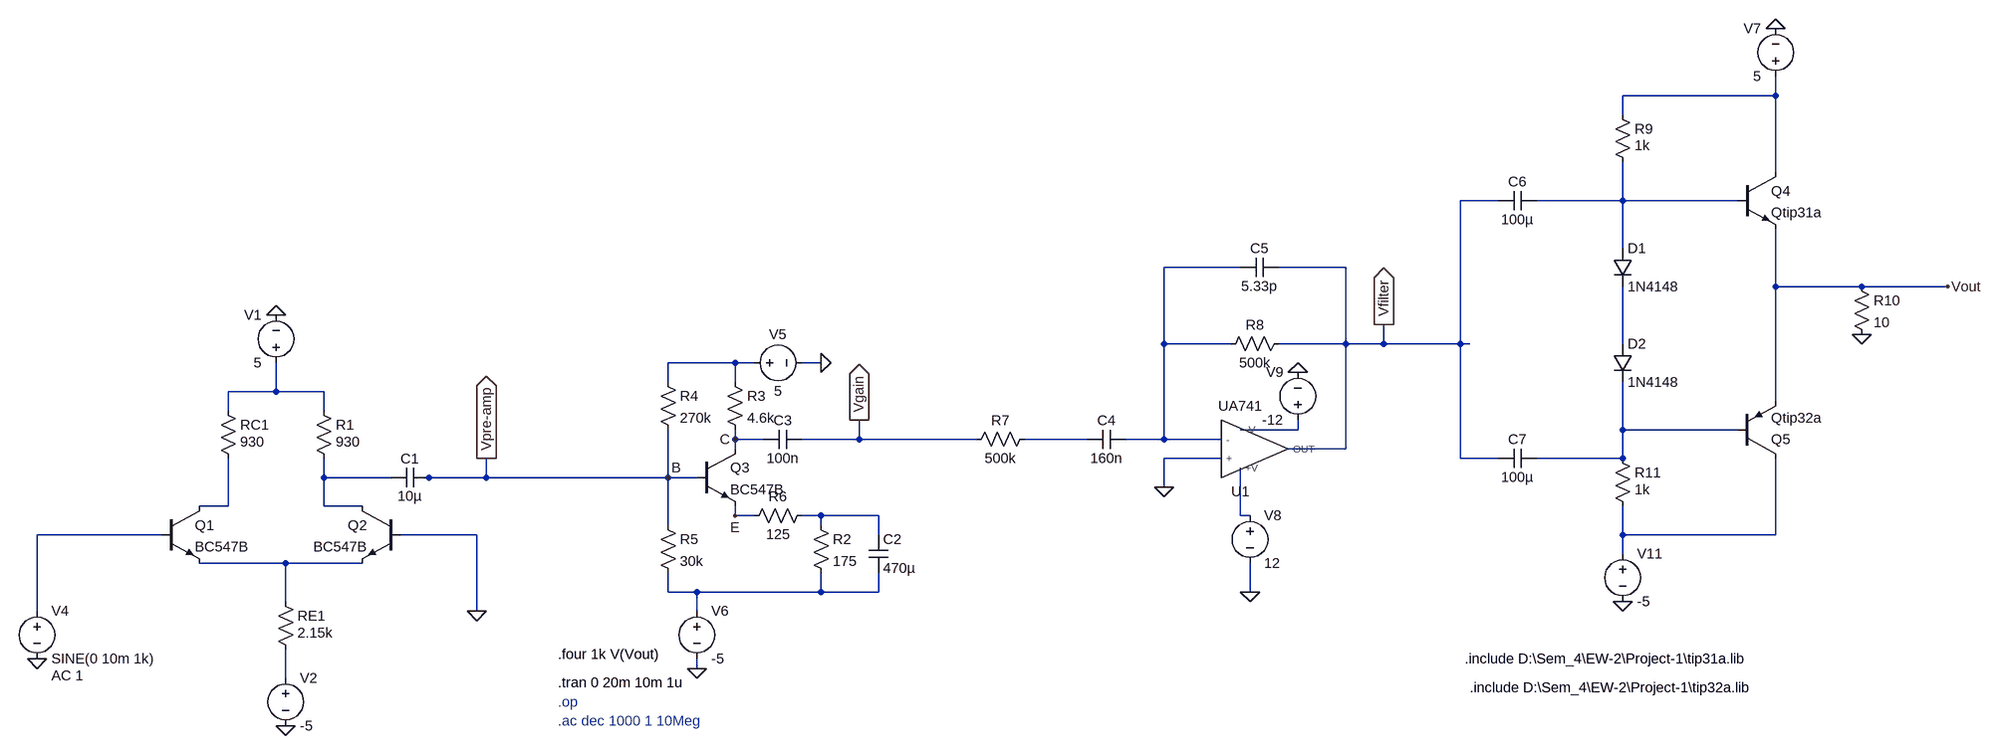
[diagram p0: schematic final_circuit.asc]
final_circuit.asc, the LTspice schematic file:
Version 4
SHEET 1 2568 680
WIRE 2208 -704 2208 -736
WIRE 2208 -704 1952 -704
WIRE 1952 -672 1952 -704
WIRE 2208 -576 2208 -704
WIRE 1744 -528 1680 -528
WIRE 1952 -528 1952 -592
WIRE 1952 -528 1808 -528
WIRE 2144 -528 1952 -528
WIRE 1952 -448 1952 -528
WIRE 1264 -416 1136 -416
WIRE 1440 -416 1328 -416
WIRE 2208 -384 2208 -480
WIRE 2352 -384 2208 -384
WIRE 2496 -384 2352 -384
WIRE 1136 -288 1136 -416
WIRE 1248 -288 1136 -288
WIRE 1440 -288 1440 -416
WIRE 1440 -288 1328 -288
WIRE 1504 -288 1504 -320
WIRE 1504 -288 1440 -288
WIRE 1680 -288 1680 -528
WIRE 1680 -288 1504 -288
WIRE 1696 -288 1680 -288
WIRE 1952 -288 1952 -384
WIRE 400 -256 288 -256
WIRE 432 -256 400 -256
WIRE 544 -256 512 -256
WIRE 288 -224 288 -256
WIRE 400 -224 400 -256
WIRE -528 -208 -528 -256
WIRE -528 -208 -608 -208
WIRE -448 -208 -528 -208
WIRE 2208 -192 2208 -384
WIRE -608 -176 -608 -208
WIRE -448 -176 -448 -208
WIRE 1360 -144 1360 -160
WIRE 1360 -144 1264 -144
WIRE 1952 -144 1952 -224
WIRE 2144 -144 1952 -144
WIRE 400 -128 400 -144
WIRE 448 -128 400 -128
WIRE 608 -128 608 -160
WIRE 608 -128 512 -128
WIRE 816 -128 608 -128
WIRE 1008 -128 896 -128
WIRE 1136 -128 1136 -288
WIRE 1136 -128 1072 -128
WIRE 1232 -128 1136 -128
WIRE 400 -112 400 -128
WIRE 1440 -112 1440 -288
WIRE 1440 -112 1344 -112
WIRE 1232 -96 1136 -96
WIRE 1680 -96 1680 -288
WIRE 1744 -96 1680 -96
WIRE 1952 -96 1952 -144
WIRE 1952 -96 1808 -96
WIRE -448 -64 -448 -96
WIRE -336 -64 -448 -64
WIRE -272 -64 -288 -64
WIRE -176 -64 -176 -96
WIRE -176 -64 -272 -64
WIRE 288 -64 288 -144
WIRE 288 -64 -176 -64
WIRE 336 -64 288 -64
WIRE 1136 -48 1136 -96
WIRE -608 -16 -608 -96
WIRE -608 -16 -656 -16
WIRE -448 -16 -448 -64
WIRE -384 -16 -448 -16
WIRE 400 0 400 -16
WIRE 432 0 400 0
WIRE 544 0 512 0
WIRE 640 0 544 0
WIRE 1264 0 1264 -80
WIRE 1280 0 1264 0
WIRE 288 16 288 -64
WIRE 544 16 544 0
WIRE -720 32 -928 32
WIRE -192 32 -320 32
WIRE 640 32 640 0
WIRE 1952 32 1952 -16
WIRE 2208 32 2208 -96
WIRE 2208 32 1952 32
WIRE 1952 64 1952 32
WIRE -512 80 -656 80
WIRE -384 80 -512 80
WIRE 288 128 288 96
WIRE 336 128 288 128
WIRE 544 128 544 96
WIRE 544 128 336 128
WIRE 640 128 640 96
WIRE 640 128 544 128
WIRE 1280 128 1280 80
WIRE -512 144 -512 80
WIRE -928 160 -928 32
WIRE -192 160 -192 32
WIRE 336 160 336 128
WIRE 336 256 336 240
WIRE -512 272 -512 224
FLAG -528 -336 0
FLAG -512 352 0
FLAG -928 240 0
FLAG 336 256 0
FLAG 544 -256 0
FLAG 400 -128 C
FLAG 400 0 E
FLAG 288 -64 B
FLAG 1136 -48 0
FLAG 1280 128 0
FLAG 1360 -240 0
FLAG 2208 -816 0
FLAG 2496 -384 Vout
FLAG 2352 -304 0
FLAG 1952 144 0
FLAG -192 160 0
FLAG 1504 -320 Vfilter
IOPIN 1504 -320 Out
FLAG 608 -160 Vgain
IOPIN 608 -160 Out
FLAG -176 -96 Vpre-amp
IOPIN -176 -96 Out
SYMBOL res -464 -192 R0
WINDOW 3 36 68 Left 2
SYMATTR Value 930
SYMATTR InstName R1
SYMBOL res -624 -192 R0
WINDOW 3 36 68 Left 2
SYMATTR Value 930
SYMATTR InstName RC1
SYMBOL voltage -528 -240 R180
WINDOW 0 24 96 Left 2
WINDOW 3 24 16 Left 2
WINDOW 123 0 0 Left 0
WINDOW 39 0 0 Left 0
SYMATTR InstName V1
SYMATTR Value 5
SYMBOL res -528 128 R0
WINDOW 3 36 68 Left 2
SYMATTR Value 2.15k
SYMATTR InstName RE1
SYMBOL voltage -512 256 R0
WINDOW 123 0 0 Left 0
WINDOW 39 0 0 Left 0
SYMATTR InstName V2
SYMATTR Value -5
SYMBOL npn -720 -16 R0
SYMATTR InstName Q1
SYMATTR Value BC547B
SYMBOL npn -320 -16 M0
SYMATTR InstName Q2
SYMATTR Value BC547B
SYMBOL voltage -928 144 R0
WINDOW 123 24 124 Left 2
WINDOW 39 0 0 Left 0
SYMATTR Value2 AC 1
SYMATTR InstName V4
SYMATTR Value SINE(0 10m 1k)
SYMBOL cap -272 -80 R90
WINDOW 0 0 32 VBottom 2
WINDOW 3 32 32 VTop 2
SYMATTR InstName C1
SYMATTR Value 10µ
SYMBOL npn 336 -112 R0
SYMATTR InstName Q3
SYMATTR Value BC547B
SYMBOL res 528 0 R0
SYMATTR InstName R2
SYMATTR Value 175
SYMBOL cap 624 32 R0
SYMATTR InstName C2
SYMATTR Value 470µ
SYMBOL res 384 -240 R0
SYMATTR InstName R3
SYMATTR Value 4.6k
SYMBOL cap 512 -144 R90
WINDOW 0 0 32 VBottom 2
WINDOW 3 32 32 VTop 2
SYMATTR InstName C3
SYMATTR Value 100n
SYMBOL res 272 -240 R0
SYMATTR InstName R4
SYMATTR Value 270k
SYMBOL res 272 0 R0
SYMATTR InstName R5
SYMATTR Value 30k
SYMBOL voltage 416 -256 R270
WINDOW 0 32 56 VTop 2
WINDOW 3 -32 56 VBottom 2
WINDOW 123 0 0 Left 0
WINDOW 39 0 0 Left 0
SYMATTR InstName V5
SYMATTR Value 5
SYMBOL voltage 336 144 R0
SYMATTR InstName V6
SYMATTR Value -5
SYMBOL res 528 -16 R90
WINDOW 0 0 56 VBottom 2
WINDOW 3 32 56 VTop 2
SYMATTR InstName R6
SYMATTR Value 125
SYMBOL res 912 -144 R90
WINDOW 0 0 56 VBottom 2
WINDOW 3 32 56 VTop 2
SYMATTR InstName R7
SYMATTR Value 500k
SYMBOL UA741 1264 -112 M180
SYMATTR InstName U1
SYMBOL cap 1072 -144 R90
WINDOW 0 0 32 VBottom 2
WINDOW 3 32 32 VTop 2
SYMATTR InstName C4
SYMATTR Value 160n
SYMBOL res 1344 -304 R90
WINDOW 0 0 56 VBottom 2
WINDOW 3 32 56 VTop 2
SYMATTR InstName R8
SYMATTR Value 500k
SYMBOL cap 1328 -432 R90
WINDOW 0 0 32 VBottom 2
WINDOW 3 32 32 VTop 2
SYMATTR InstName C5
SYMATTR Value 5.33p
SYMBOL voltage 1280 -16 R0
WINDOW 123 0 0 Left 0
WINDOW 39 0 0 Left 0
SYMATTR InstName V8
SYMATTR Value 12
SYMBOL voltage 1360 -144 R180
WINDOW 0 24 96 Left 2
WINDOW 3 24 16 Left 2
WINDOW 123 0 0 Left 0
WINDOW 39 0 0 Left 0
SYMATTR InstName V9
SYMATTR Value -12
SYMBOL npn 2144 -576 R0
SYMATTR InstName Q4
SYMATTR Value Qtip31a
SYMBOL voltage 2208 -720 R180
WINDOW 0 24 96 Left 2
WINDOW 3 24 16 Left 2
WINDOW 123 0 0 Left 0
WINDOW 39 0 0 Left 0
SYMATTR InstName V7
SYMATTR Value 5
SYMBOL res 1936 -688 R0
WINDOW 3 36 68 Left 2
SYMATTR Value 1k
SYMATTR InstName R9
SYMBOL res 2336 -400 R0
SYMATTR InstName R10
SYMATTR Value 10
SYMBOL cap 1808 -544 R90
WINDOW 0 0 32 VBottom 2
WINDOW 3 32 32 VTop 2
SYMATTR InstName C6
SYMATTR Value 100µ
SYMBOL cap 1808 -112 R90
WINDOW 0 0 32 VBottom 2
WINDOW 3 32 32 VTop 2
SYMATTR InstName C7
SYMATTR Value 100µ
SYMBOL res 1936 -112 R0
WINDOW 3 36 68 Left 2
SYMATTR Value 1k
SYMATTR InstName R11
SYMBOL voltage 1952 48 R0
WINDOW 123 0 0 Left 0
WINDOW 39 0 0 Left 0
SYMATTR InstName V11
SYMATTR Value -5
SYMBOL pnp 2144 -96 M180
SYMATTR InstName Q5
SYMATTR Value Qtip32a
SYMBOL diode 1936 -448 R0
SYMATTR InstName D1
SYMATTR Value 1N4148
SYMBOL diode 1936 -288 R0
SYMATTR InstName D2
SYMATTR Value 1N4148
TEXT 104 280 Left 2 !.tran 0 20m 10m 1u
TEXT 104 312 Left 2 ;.op
TEXT 1688 240 Left 2 !.include D:\\Sem_4\\EW-2\\Project-1\\tip31a.lib
TEXT 1696 288 Left 2 !.include D:\\Sem_4\\EW-2\\Project-1\\tip32a.lib
TEXT 104 344 Left 2 ;.ac dec 1000 1 10Meg
TEXT 104 232 Left 2 !.four 1k V(Vout)

The netlist it stands for:
* final_circuit.asc
R1 N006 N010 930
RC1 N006 N011 930
V1 N006 0 5
RE1 N016 N018 2.15k
V2 N018 0 -5
Q1 N011 N014 N016 0 BC547B
Q2 N010 0 N016 0 BC547B
V4 N014 0 SINE(0 10m 1k) AC 1
C1 Vpre-amp N010 10µ
Q3 C Vpre-amp E 0 BC547B
R2 N012 N017 175
C2 N012 N017 470µ
R3 N005 C 4.6k
C3 Vgain C 100n
R4 N005 Vpre-amp 270k
R5 Vpre-amp N017 30k
V5 N005 0 5
V6 N017 0 -5
R6 N012 E 125
R7 N009 Vgain 500k
XU1 0 N003 N013 N007 Vfilter UA741  ; pins + - +V -V OUT
C4 N003 N009 160n
R8 Vfilter N003 500k
C5 Vfilter N003 5.33p
V8 N013 0 12
V9 N007 0 -12
Q4 N001 N002 Vout 0 Qtip31a
V7 N001 0 5
R9 N001 N002 1k
R10 Vout 0 10
C6 N002 Vfilter 100µ
C7 N008 Vfilter 100µ
R11 N008 N015 1k
V11 N015 0 -5
Q5 N015 N008 Vout 0 Qtip32a
D1 N002 N004 1N4148
D2 N004 N008 1N4148
.model D D
.lib standard.dio
.model NPN NPN
.model PNP PNP
.lib standard.bjt
.tran 0 20m 10m 1u
* .op
.include D:\Sem_4\EW-2\Project-1\tip31a.lib
.include D:\Sem_4\EW-2\Project-1\tip32a.lib
* .ac dec 1000 1 10Meg
.four 1k V(Vout)
.lib D:\Sem_2\AEC\Subcircuit for Lab 8 Prelab.txt
.backanno
.end